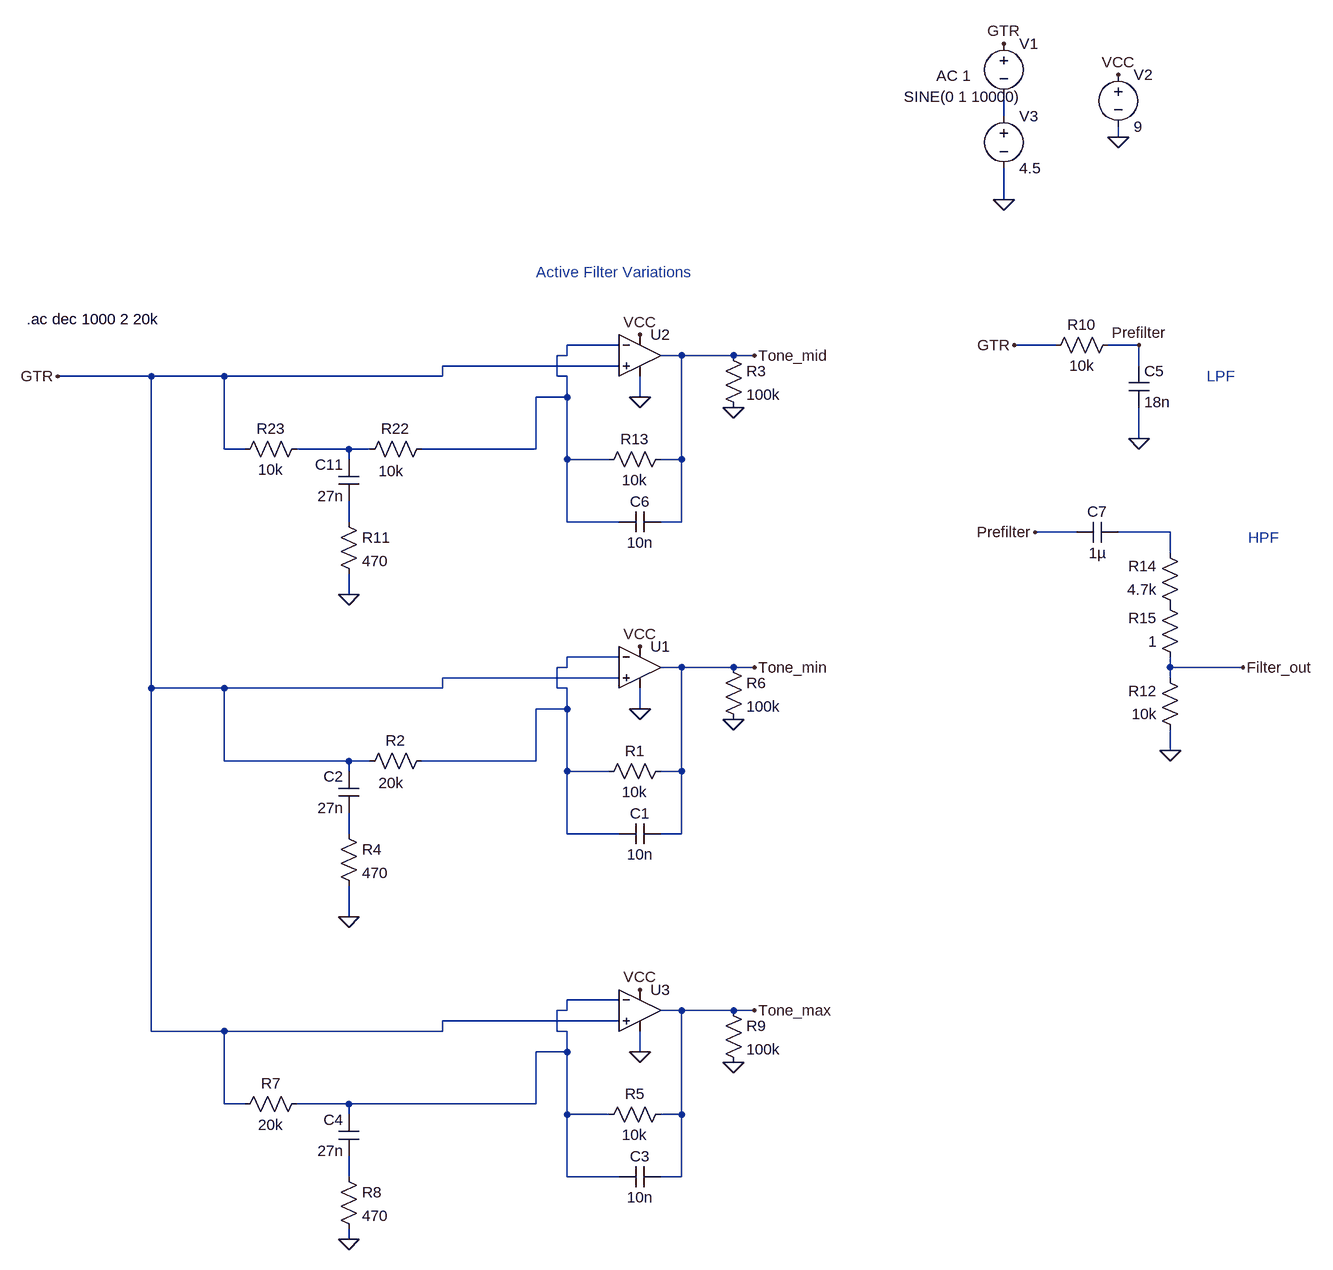
[diagram p0: schematic SD-1_Tone_Circuit.asc]
SD-1_Tone_Circuit.asc, the LTspice schematic file:
Version 4
SHEET 1 2548 868
WIRE 912 -880 912 -912
WIRE 1088 -848 1088 -864
WIRE 912 -752 912 -800
WIRE 320 -528 240 -528
WIRE 992 -528 928 -528
WIRE 1120 -528 1072 -528
WIRE 240 -512 240 -528
WIRE 240 -512 224 -512
WIRE 416 -512 384 -512
WIRE 496 -512 416 -512
WIRE 528 -512 496 -512
WIRE 320 -496 48 -496
WIRE 1120 -496 1120 -528
WIRE -400 -480 -544 -480
WIRE -288 -480 -400 -480
WIRE 48 -480 48 -496
WIRE 48 -480 -288 -480
WIRE 224 -480 224 -512
WIRE 240 -480 224 -480
WIRE 240 -448 240 -480
WIRE 240 -448 192 -448
WIRE 352 -448 352 -480
WIRE 1120 -384 1120 -432
WIRE -288 -368 -288 -480
WIRE -256 -368 -288 -368
WIRE -96 -368 -176 -368
WIRE -64 -368 -96 -368
WIRE 192 -368 192 -448
WIRE 192 -368 16 -368
WIRE -96 -352 -96 -368
WIRE 240 -352 240 -448
WIRE 304 -352 240 -352
WIRE 416 -352 416 -512
WIRE 416 -352 384 -352
WIRE -96 -256 -96 -288
WIRE 240 -256 240 -352
WIRE 320 -256 240 -256
WIRE 416 -256 416 -352
WIRE 416 -256 384 -256
WIRE 1024 -240 960 -240
WIRE 1168 -240 1088 -240
WIRE 1168 -208 1168 -240
WIRE -96 -144 -96 -176
WIRE 320 -48 240 -48
WIRE 240 -32 240 -48
WIRE 240 -32 224 -32
WIRE 416 -32 384 -32
WIRE 496 -32 416 -32
WIRE 528 -32 496 -32
WIRE 1168 -32 1168 -48
WIRE 1280 -32 1168 -32
WIRE 320 -16 48 -16
WIRE 1168 -16 1168 -32
WIRE -400 0 -400 -480
WIRE -288 0 -400 0
WIRE 48 0 48 -16
WIRE 48 0 -288 0
WIRE 224 0 224 -32
WIRE 240 0 224 0
WIRE 240 32 240 0
WIRE 240 32 192 32
WIRE 352 32 352 0
WIRE 1168 96 1168 64
WIRE -288 112 -288 0
WIRE -96 112 -288 112
WIRE -64 112 -96 112
WIRE 192 112 192 32
WIRE 192 112 16 112
WIRE -96 128 -96 112
WIRE 240 128 240 32
WIRE 304 128 240 128
WIRE 416 128 416 -32
WIRE 416 128 384 128
WIRE -96 224 -96 192
WIRE 240 224 240 128
WIRE 320 224 240 224
WIRE 416 224 416 128
WIRE 416 224 384 224
WIRE -96 352 -96 304
WIRE 320 480 240 480
WIRE 240 496 240 480
WIRE 240 496 224 496
WIRE 416 496 384 496
WIRE 496 496 416 496
WIRE 528 496 496 496
WIRE 320 512 48 512
WIRE -400 528 -400 0
WIRE -288 528 -400 528
WIRE 48 528 48 512
WIRE 48 528 -288 528
WIRE 224 528 224 496
WIRE 240 528 224 528
WIRE 240 560 240 528
WIRE 240 560 192 560
WIRE 352 560 352 528
WIRE -288 640 -288 528
WIRE -256 640 -288 640
WIRE -96 640 -176 640
WIRE 192 640 192 560
WIRE 192 640 -96 640
WIRE -96 656 -96 640
WIRE 240 656 240 560
WIRE 304 656 240 656
WIRE 416 656 416 496
WIRE 416 656 384 656
WIRE -96 752 -96 720
WIRE 240 752 240 656
WIRE 320 752 240 752
WIRE 416 752 416 656
WIRE 416 752 384 752
WIRE -96 848 -96 832
FLAG 1088 -848 0
FLAG 912 -992 GTR
FLAG 1088 -944 VCC
FLAG 352 -544 VCC
FLAG 528 -512 Tone_mid
FLAG -96 -144 0
FLAG 352 -64 VCC
FLAG 528 -32 Tone_min
FLAG -96 352 0
FLAG 352 464 VCC
FLAG 528 496 Tone_max
FLAG -96 848 0
FLAG 496 -432 0
FLAG 496 48 0
FLAG 496 576 0
FLAG 352 -448 0
FLAG 352 32 0
FLAG 352 560 0
FLAG 912 -752 0
FLAG 928 -528 GTR
FLAG 1120 -384 0
FLAG 1120 -528 Prefilter
FLAG 1168 96 0
FLAG 1280 -32 Filter_out
FLAG -544 -480 GTR
FLAG 960 -240 Prefilter
SYMBOL voltage 912 -1008 R0
WINDOW 3 -154 98 Left 2
WINDOW 123 -104 65 Left 2
WINDOW 39 0 0 Left 0
SYMATTR Value SINE(0 1 10000)
SYMATTR Value2 AC 1
SYMATTR InstName V1
SYMBOL voltage 1088 -960 R0
WINDOW 123 0 0 Left 0
WINDOW 39 0 0 Left 0
SYMATTR InstName V2
SYMATTR Value 9
SYMBOL Opamps\\UniversalOpamp2 352 -512 R0
SYMATTR InstName U2
SYMBOL res 400 -368 R90
WINDOW 0 0 56 VBottom 2
WINDOW 3 32 56 VTop 2
SYMATTR InstName R13
SYMATTR Value 10k
SYMBOL cap 384 -272 R90
WINDOW 0 0 32 VBottom 2
WINDOW 3 32 32 VTop 2
SYMATTR InstName C6
SYMATTR Value 10n
SYMBOL res 32 -384 R90
WINDOW 0 0 56 VBottom 2
WINDOW 3 34 63 VTop 2
SYMATTR InstName R22
SYMATTR Value 10k
SYMBOL cap -80 -288 R180
WINDOW 0 24 56 Left 2
WINDOW 3 24 8 Left 2
SYMATTR InstName C11
SYMATTR Value 27n
SYMBOL res -160 -384 R90
WINDOW 0 0 56 VBottom 2
WINDOW 3 32 56 VTop 2
SYMATTR InstName R23
SYMATTR Value 10k
SYMBOL res -112 -272 R0
SYMATTR InstName R11
SYMATTR Value 470
SYMBOL Opamps\\UniversalOpamp2 352 -32 R0
SYMATTR InstName U1
SYMBOL res 400 112 R90
WINDOW 0 0 56 VBottom 2
WINDOW 3 32 56 VTop 2
SYMATTR InstName R1
SYMATTR Value 10k
SYMBOL cap 384 208 R90
WINDOW 0 0 32 VBottom 2
WINDOW 3 32 32 VTop 2
SYMATTR InstName C1
SYMATTR Value 10n
SYMBOL res 32 96 R90
WINDOW 0 0 56 VBottom 2
WINDOW 3 34 63 VTop 2
SYMATTR InstName R2
SYMATTR Value 20k
SYMBOL cap -80 192 R180
WINDOW 0 24 56 Left 2
WINDOW 3 24 8 Left 2
SYMATTR InstName C2
SYMATTR Value 27n
SYMBOL res -112 208 R0
SYMATTR InstName R4
SYMATTR Value 470
SYMBOL Opamps\\UniversalOpamp2 352 496 R0
SYMATTR InstName U3
SYMBOL res 400 640 R90
WINDOW 0 0 56 VBottom 2
WINDOW 3 32 56 VTop 2
SYMATTR InstName R5
SYMATTR Value 10k
SYMBOL cap 384 736 R90
WINDOW 0 0 32 VBottom 2
WINDOW 3 32 32 VTop 2
SYMATTR InstName C3
SYMATTR Value 10n
SYMBOL cap -80 720 R180
WINDOW 0 24 56 Left 2
WINDOW 3 24 8 Left 2
SYMATTR InstName C4
SYMATTR Value 27n
SYMBOL res -160 624 R90
WINDOW 0 0 56 VBottom 2
WINDOW 3 32 56 VTop 2
SYMATTR InstName R7
SYMATTR Value 20k
SYMBOL res -112 736 R0
SYMATTR InstName R8
SYMATTR Value 470
SYMBOL res 480 -528 R0
SYMATTR InstName R3
SYMATTR Value 100k
SYMBOL res 480 -48 R0
SYMATTR InstName R6
SYMATTR Value 100k
SYMBOL res 480 480 R0
SYMATTR InstName R9
SYMATTR Value 100k
SYMBOL voltage 912 -896 R0
WINDOW 123 0 0 Left 0
WINDOW 39 0 0 Left 0
SYMATTR InstName V3
SYMATTR Value 4.5
SYMBOL res 1088 -544 R90
WINDOW 0 0 56 VBottom 2
WINDOW 3 32 56 VTop 2
SYMATTR InstName R10
SYMATTR Value 10k
SYMBOL cap 1104 -496 R0
SYMATTR InstName C5
SYMATTR Value 18n
SYMBOL cap 1088 -256 R90
WINDOW 0 0 32 VBottom 2
WINDOW 3 32 32 VTop 2
SYMATTR InstName C7
SYMATTR Value 1µ
SYMBOL res 1184 -112 R180
WINDOW 0 36 76 Left 2
WINDOW 3 36 40 Left 2
SYMATTR InstName R14
SYMATTR Value 4.7k
SYMBOL res 1184 80 R180
WINDOW 0 36 76 Left 2
WINDOW 3 36 40 Left 2
SYMATTR InstName R12
SYMATTR Value 10k
SYMBOL res 1184 -32 R180
WINDOW 0 36 76 Left 2
WINDOW 3 36 40 Left 2
SYMATTR InstName R15
SYMATTR Value 1
TEXT -592 -568 Left 2 !.ac dec 1000 2 20k
TEXT 1224 -480 Left 2 ;LPF
TEXT 1288 -232 Left 2 ;HPF
TEXT 192 -640 Left 2 ;Active Filter Variations

The netlist it stands for:
* SD-1_Tone_Circuit.asc
V1 GTR N001 SINE(0 1 10000) AC 1
V2 VCC 0 9
XU2 GTR N002 VCC 0 Tone_mid level.2 Avol=1Meg GBW=10Meg Slew=10Meg ilimit=25m rail=0 Vos=0 phimargin=45 en=0 enk=0 in=0 ink=0 Rin=500Meg  ; pins IN+ IN- V+ V- OUT
R13 Tone_mid N002 10k
C6 Tone_mid N002 10n
R22 N002 N003 10k
C11 N004 N003 27n
R23 N003 GTR 10k
R11 N004 0 470
XU1 GTR N006 VCC 0 Tone_min level.2 Avol=1Meg GBW=10Meg Slew=10Meg ilimit=25m rail=0 Vos=0 phimargin=45 en=0 enk=0 in=0 ink=0 Rin=500Meg  ; pins IN+ IN- V+ V- OUT
R1 Tone_min N006 10k
C1 Tone_min N006 10n
R2 N006 GTR 20k
C2 N007 GTR 27n
R4 N007 0 470
XU3 GTR N008 VCC 0 Tone_max level.2 Avol=1Meg GBW=10Meg Slew=10Meg ilimit=25m rail=0 Vos=0 phimargin=45 en=0 enk=0 in=0 ink=0 Rin=500Meg  ; pins IN+ IN- V+ V- OUT
R5 Tone_max N008 10k
C3 Tone_max N008 10n
C4 N009 N008 27n
R7 N008 GTR 20k
R8 N009 0 470
R3 Tone_mid 0 100k
R6 Tone_min 0 100k
R9 Tone_max 0 100k
V3 N001 0 4.5
R10 Prefilter GTR 10k
C5 Prefilter 0 18n
C7 N005 Prefilter 1µ
R14 P001 N005 4.7k
R12 0 Filter_out 10k
R15 Filter_out P001 1
.ac dec 1000 2 20k
* LPF
* HPF
* Active Filter Variations
.lib UniversalOpamps2.sub
.backanno
.end